# EasyEDA Pro project AE.eprj

# Schematic esquematico-controladora
Board Name: Controladora; Create Date: 2026-03-11; Page Name: FolhaControladora; Project Name: AE; Schematic Name: esquematico-controladora; Update Date: 2026-03-11; Company: EasyEDA.com; Page Size: A4; Version: V1.0
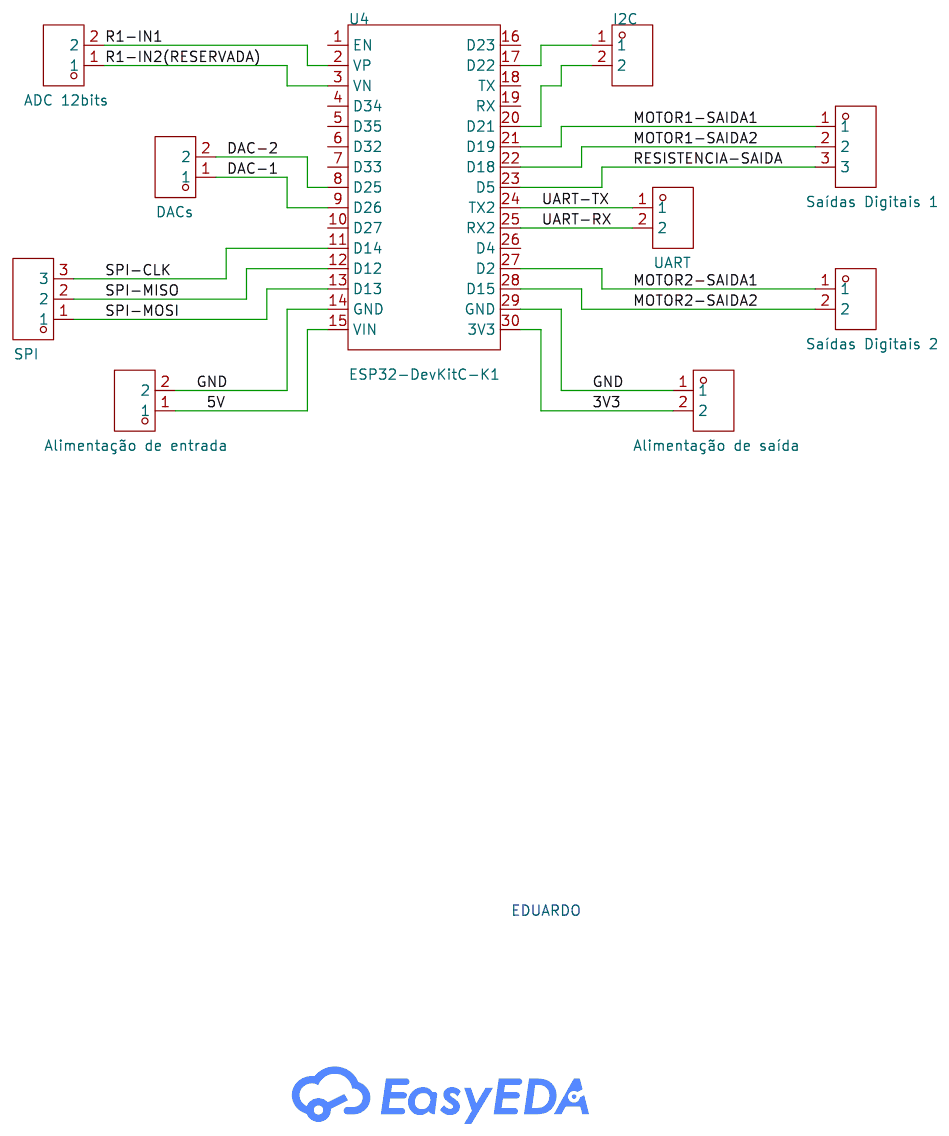
[diagram p0: schematic sheet]

## Parts
ADC12bits  ADC 12bits  [CONN-TH_P5.08_KF128L-5.08-2P]
Alimentaçãodeentrada  Alimentação de entrada  [CONN-TH_P5.08_KF128L-5.08-2P]
Alimentaçãodesaída  Alimentação de saída  [CONN-TH_P5.08_KF128L-5.08-2P]
DACs  DACs  [CONN-TH_P5.08_KF128L-5.08-2P]
I2C  I2C  [CONN-TH_P5.08_KF128L-5.08-2P]
SaídasDigitais1  Saídas Digitais 1  [CONN-TH_3P-P5.00_KF128-5.0-3P]
SaídasDigitais2  Saídas Digitais 2  [CONN-TH_P5.08_KF128L-5.08-2P]
SPI  SPI  [CONN-TH_3P-P5.00_KF128-5.0-3P]
U4  ESP32-DevKitC-K1  [BULETM-SMD_ESP32-DEVKITC]
UART  UART  [CONN-TH_P5.08_KF128L-5.08-2P]

## Library data of the parts
ADC12bits Alimentaçãodeentrada Alimentaçãodesaída DACs I2C SaídasDigitais2 UART = KF128L-5.08-2P: LCSC Part Name: 1x2P 5.08mm 直插 排数:1 每排P数:2; Supplier Part: C474940; Manufacturer: KEFA(科发); Supplier Footprint: 插件,P=5.08mm; JLCPCB Part Class: Extended Part; Datasheet: https://item.szlcsc.com/datasheet/KF128L-5.08-2P/481558.html; Supplier: LCSC; Number of Positions or Pins: 1x2P; Pitch: 5.08mm; Color: Green; Mounting Type: Through Hole; Number of Pins: 2P; Number of Rows: 1; Number of PINs Per Row: 2; Current Rating: 24A; Voltage Rating (Max): 250V; Wire Gauge - AWG: 12~22; Wire Gauge - mm2: 2.5; Operating Temperature: -40℃~+105℃
SaídasDigitais1 = KF128-5.0-3P: LCSC Part Name: 1x3P 5mm 直插 排数:1 每排P数:3; Supplier Part: C474951; Manufacturer: KEFA(科发); Manufacturer Part: SPI; Supplier Footprint: 插件,P=5mm; JLCPCB Part Class: Extended Part; Datasheet: https://item.szlcsc.com/datasheet/KF128-5.0-3P/481569.html; Supplier: LCSC; Number of Positions or Pins: 1x3P; Pitch: 5mm; Color: Green; Mounting Type: Through Hole; Number of Pins: 3P; Number of Rows: 1; Number of PINs Per Row: 3; Current Rating: 24A; Voltage Rating (Max): 250V; Wire Gauge - AWG: 12~22; Wire Gauge - mm2: 2.5; Operating Temperature: -40℃~+105℃
SPI = KF128-5.0-3P: LCSC Part Name: 1x3P 5mm 直插 排数:1 每排P数:3; Supplier Part: C474951; Manufacturer: KEFA(科发); Supplier Footprint: 插件,P=5mm; JLCPCB Part Class: Extended Part; Datasheet: https://item.szlcsc.com/datasheet/KF128-5.0-3P/481569.html; Supplier: LCSC; Number of Positions or Pins: 1x3P; Pitch: 5mm; Color: Green; Mounting Type: Through Hole; Number of Pins: 3P; Number of Rows: 1; Number of PINs Per Row: 3; Current Rating: 24A; Voltage Rating (Max): 250V; Wire Gauge - AWG: 12~22; Wire Gauge - mm2: 2.5; Operating Temperature: -40℃~+105℃
U4 = ESP32-DevKitC: CPU:- ROM Size:- Number of I/O: USB:- WIFI Protocols:- Bluetooth:- Ethernet:- Audio & Video Interface:- Multimedia Support:- Card Type:- Power Supply Type:- Power Supply:- POE Support:- Resolution:- Temperature Range:-; LCSC Part Name: 开发板; Supplier Part: C571180; Manufacturer: ESPRESSIF(乐鑫); JLCPCB Part Class: Extended Part; Datasheet: https://atta.szlcsc.com/upload/public/pdf/source/20200521/C529586_D6FCDAFCFF160B3EDDF7DF28D600699D.pdf; Supplier: LCSC

## Nets
3V3: Alimentaçãodesaída.2 U4.30(3V3)
5V: Alimentaçãodeentrada.1 U4.15(VIN)
GND: Alimentaçãodeentrada.2 Alimentaçãodesaída.1 U4.14(GND) U4.29(GND)
DAC-1: DACs.1 U4.9(D26)
DAC-2: DACs.2 U4.8(D25)
MOTOR1-SAIDA1: SaídasDigitais1.1 U4.21(D19)
MOTOR1-SAIDA2: SaídasDigitais1.2 U4.22(D18)
MOTOR2-SAIDA1: SaídasDigitais2.1 U4.27(D2)
MOTOR2-SAIDA2: SaídasDigitais2.2 U4.28(D15)
R1-IN1: ADC12bits.2 U4.2(VP)
R1-IN2(RESERVADA): ADC12bits.1 U4.3(VN)
RESISTENCIA-SAIDA: SaídasDigitais1.3 U4.23(D5)
SPI-CLK: SPI.3 U4.11(D14)
SPI-MISO: SPI.2 U4.12(D12)
SPI-MOSI: SPI.1 U4.13(D13)
UART-RX: U4.25(RX2) UART.2
UART-TX: U4.24(TX2) UART.1
$1N2586: I2C.1 U4.17(D22)
$1N2592: I2C.2 U4.20(D21)

Not connected (* = marked no-connect by the designer): U4 1(EN) 4(D34) 5(D35) 6(D32) 7(D33) 10(D27) 16(D23) 18(TX) 19(RX) 26(D4)

## Notes on the sheet
- EDUARDO

# Board PCB-controladora
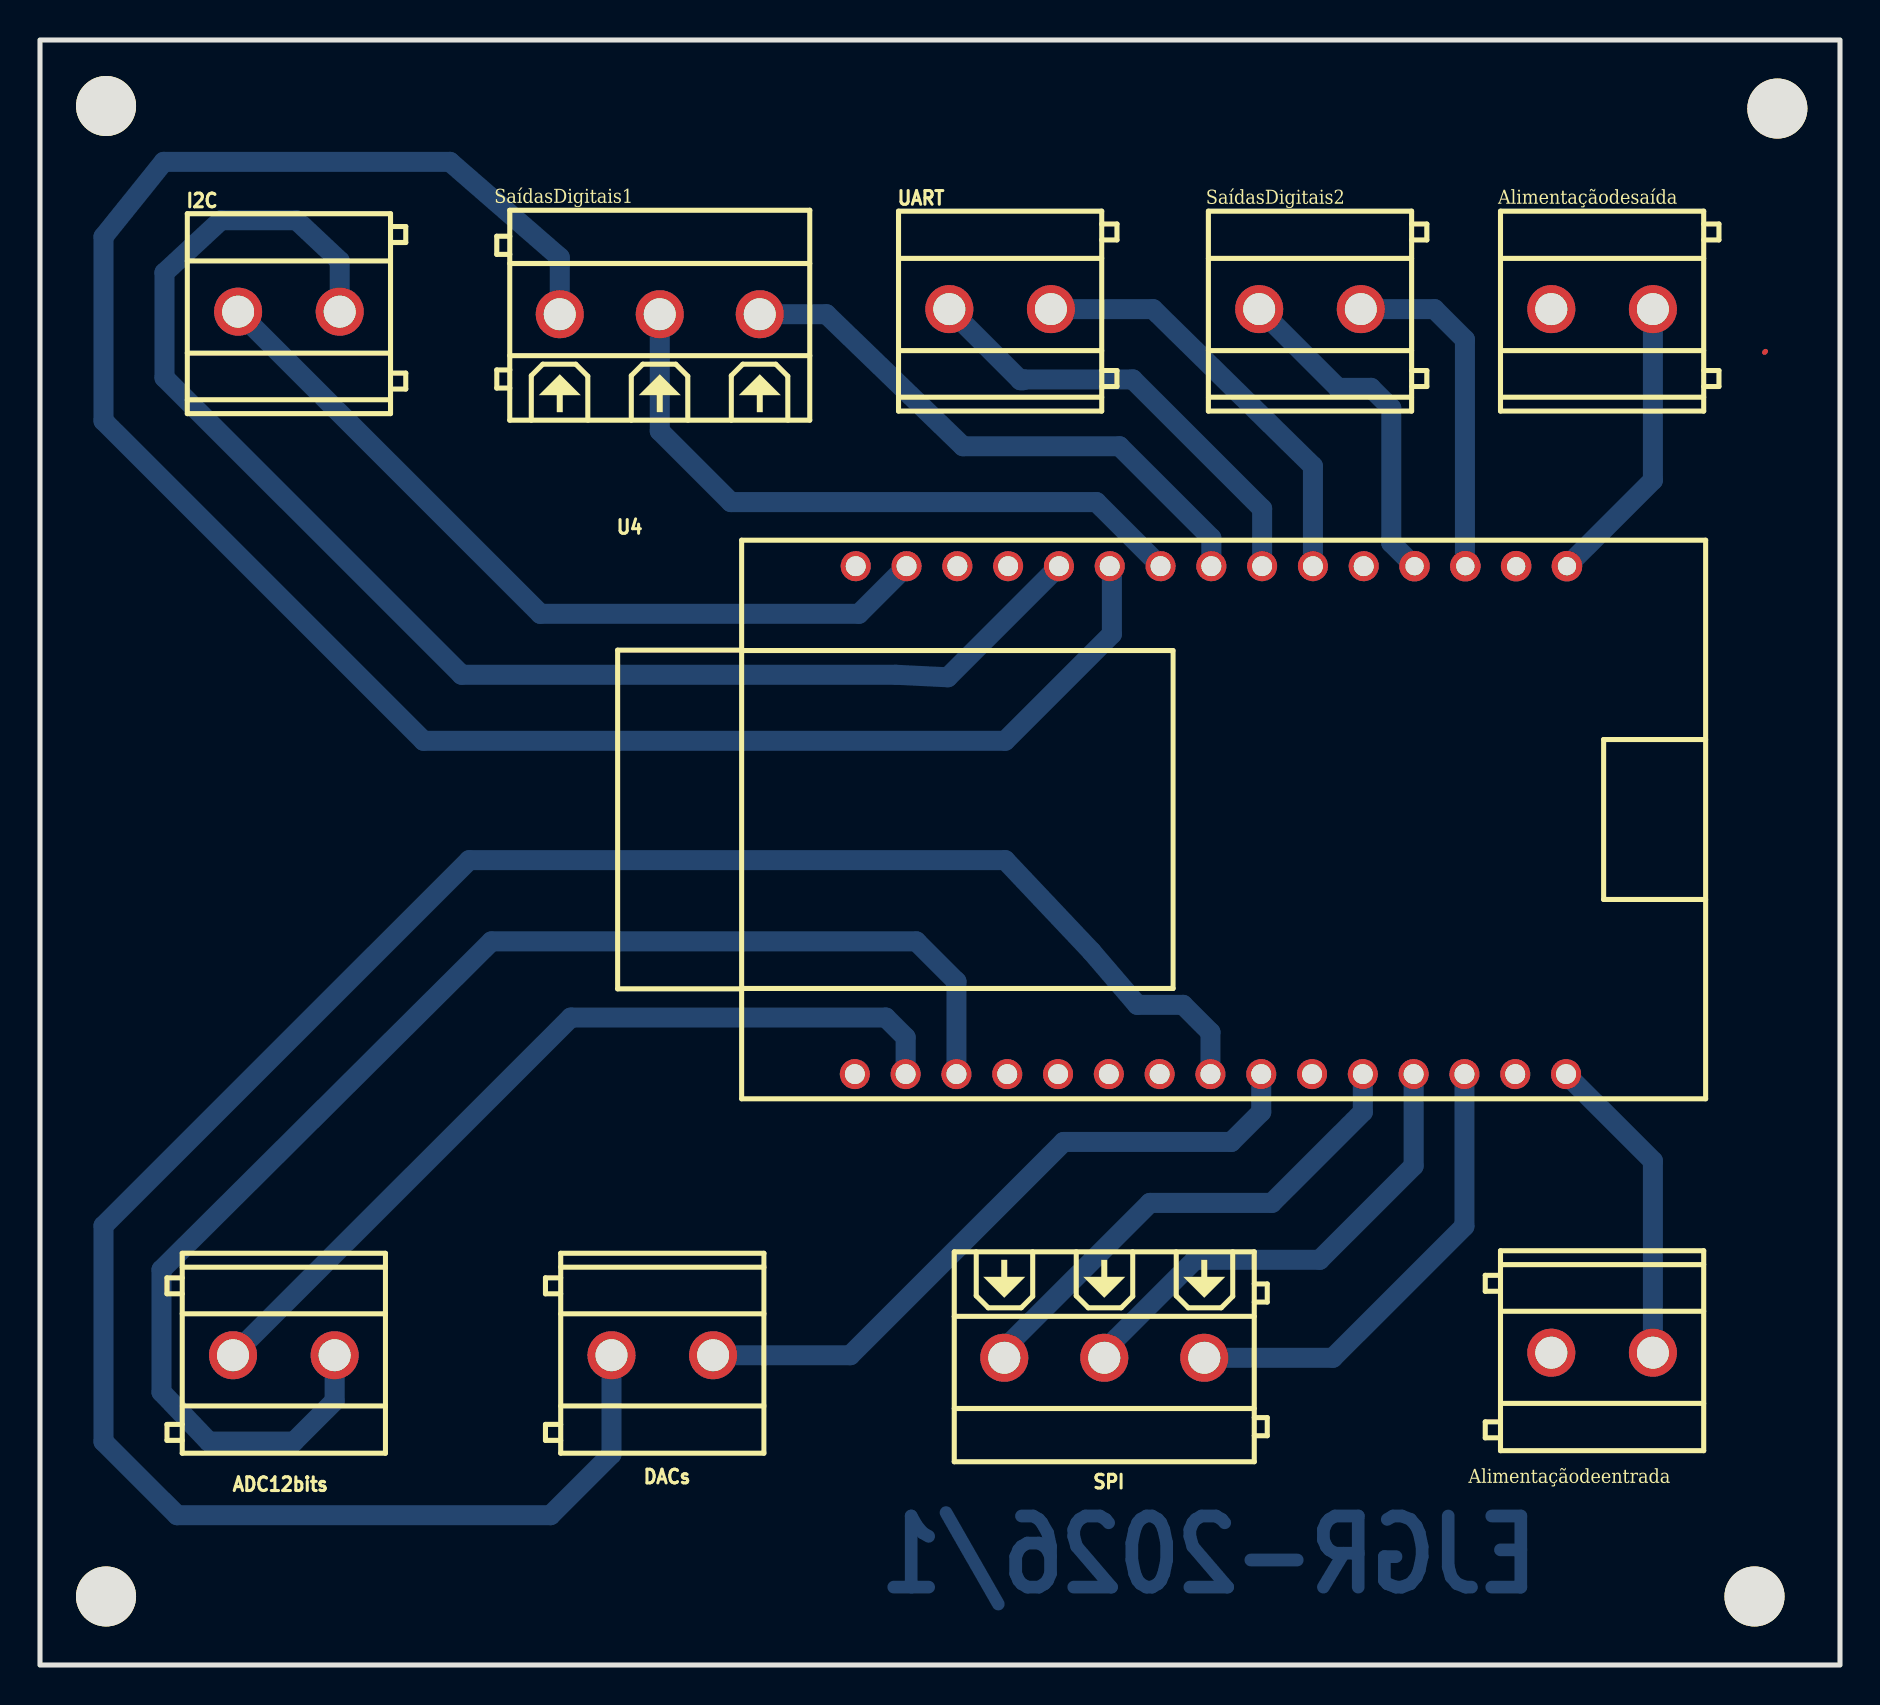
[diagram p1: board, top side]
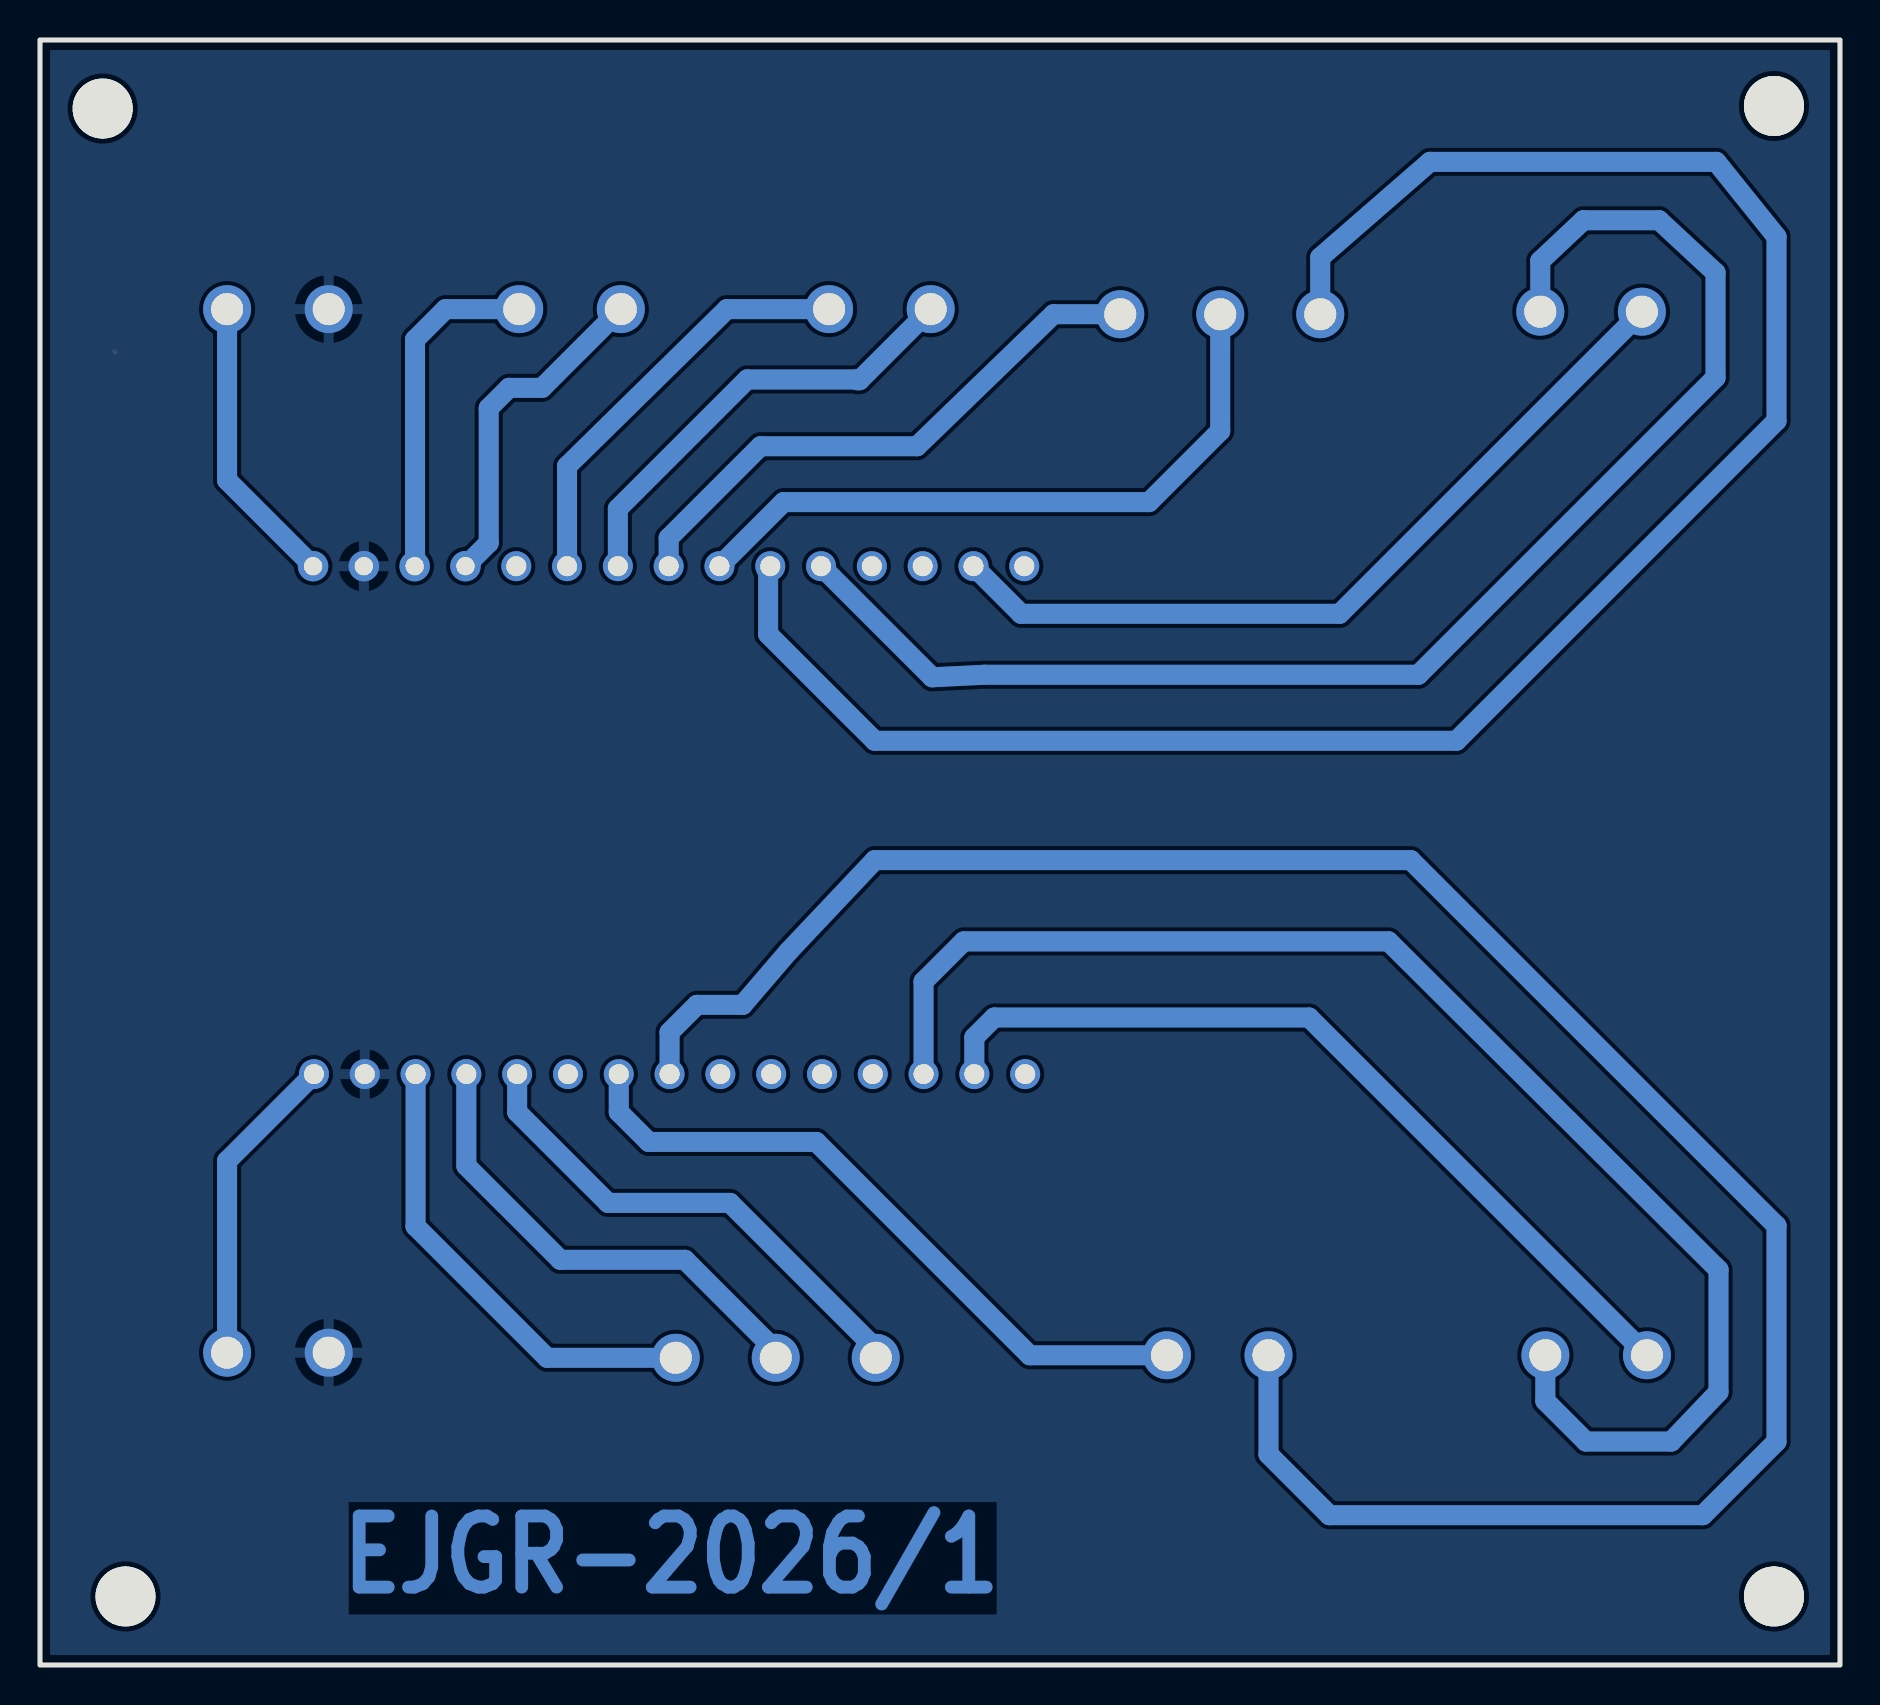
[diagram p2: board, bottom side, seen from below]

Outline 90 x 81.28 mm; copper layers: Top Layer, Bottom Layer. Coordinates in mm from the lower left corner of the outline.
Outline path: rectangle 0,81.28 90,0
Stack: Top Layer 0.035mm / Dielectric1 1.51mm FR4 er 4.5 / Bottom Layer 0.035mm

## Design rules (mm)
template: Custom Config
spacing copperThickness1oz (default): track to track 0.102, other pairs 0.152 to 0.3
spacing copperThickness2oz: track to track 0.203, other pairs 0.152 to 0.3
track width copperThickness1oz (default): min 0.127, default 0.254, max 2.54
track width copperThickness2oz: min 0.203, default 0.254, max 2.54
differential pair differentialPair (default): width min 0.127, default 0.254, max 2.54; gap min 0.152, default 0.152
via viaSize (default): diameter min 0.5, default 0.61, max 10; hole min 0.3, default 0.305, max 6.3
pour e336 uses copperRegion

## Placement (name value [footprint] x y rotation side)
ADC12bits  ADC 12bits  [CONN-TH_P5.08_KF128L-5.08-2P]  12.19 15.49 180 top
Alimentaçãodeentrada  Alimentação de entrada  [CONN-TH_P5.08_KF128L-5.08-2P]  78.1 15.62 180 top
Alimentaçãodesaída  Alimentação de saída  [CONN-TH_P5.08_KF128L-5.08-2P]  78.1 67.82 0 top
DACs  DACs  [CONN-TH_P5.08_KF128L-5.08-2P]  31.12 15.49 180 top
I2C  I2C  [CONN-TH_P5.08_KF128L-5.08-2P]  12.45 67.69 0 top
NOREF  -  [Pad_e24]  85.72 3.43 0 top
NOREF#2  -  [Pad_e17]  3.3 77.98 0 top
NOREF#3  -  [Pad_e22]  86.87 77.85 0 top
NOREF#4  -  [Pad_e23]  3.3 3.43 0 top
SaídasDigitais1  Saídas Digitais 1  [CONN-TH_3P-P5.00_KF128-5.0-3P]  30.99 67.56 0 top
SaídasDigitais2  Saídas Digitais 2  [CONN-TH_P5.08_KF128L-5.08-2P]  63.5 67.82 0 top
SPI  SPI  [CONN-TH_3P-P5.00_KF128-5.0-3P]  53.21 15.37 180 top
U4  ESP32-DevKitC-K1  [BULETM-SMD_ESP32-DEVKITC]  59.18 42.29 0 top
UART  UART  [CONN-TH_P5.08_KF128L-5.08-2P]  48.01 67.82 0 top

## Footprints (pads in the part's own frame, mm; a bottom-side part is the same pattern mirrored in y, then rotated)
BULETM-SMD_ESP32-DEVKITC
  round 1.5 hole 1: 1(-18.44,-12.735) 2(-15.9,-12.735) 3(-13.36,-12.735) 4(-10.82,-12.735) 5(-8.28,-12.735) 6(-5.74,-12.735) 7(-3.2,-12.735) 8(-0.66,-12.735) 9(1.88,-12.735) 10(4.42,-12.735) 11(6.96,-12.735) 12(9.5,-12.735) 13(12.04,-12.735) 14(14.58,-12.735) 15(17.12,-12.735) 16(-18.395,12.67) 17(-15.855,12.67) 18(-13.315,12.67) 19(-10.775,12.67) 20(-8.235,12.67) 21(-5.695,12.67) 22(-3.155,12.67) 23(-0.615,12.67) 24(1.925,12.67) 25(4.465,12.67) 26(7.005,12.67)
  round 1.524 hole 0.914: 27(9.545,12.67) 28(12.085,12.67) 29(14.625,12.67) 30(17.165,12.67)
CONN-TH_3P-P5.00_KF128-5.0-3P
  round 2.4 hole 1.6: 1(-5,0) 2(0,0) 3(5,0)
CONN-TH_P5.08_KF128L-5.08-2P
  round 2.4 hole 1.6: 1(-2.54,0) 2(2.54,0)
Pad_e17
  round 3 hole 3x2.5: 1(0,0)
Pad_e22
  round 3 hole 3x2.5: 1(0,0)
Pad_e23
  round 3 hole 3x2.5: 1(0,0)
Pad_e24
  round 3 hole 3x2.5: 1(0,0)

## Nets
As in the schematic.

Pads without a net: NOREF 1; NOREF#2 1; NOREF#3 1; NOREF#4 1; U4 1 4 5 6 7 10 16 18 19 26

## Routing (per net, layer and track width the routed paths; a pad name or vN(x,y) marks a point on that pad's centre or on a via; arc(x,y) is an arc through that point)
3V3: length 14.6
  Bottom Layer w1.001: Alimentaçãodesaída.2 80.65,59.26 76.35,54.96
5V: length 15.7
  Bottom Layer w1.001: U4.15 80.65,25.21 Alimentaçãodeentrada.1
DAC-1: length 34.3
  Bottom Layer w1.001: DACs.1 40.51,15.49 51.18,26.16 59.56,26.16 61.06,27.66 U4.9
DAC-2: length 112.7
  Bottom Layer w1.001: 28.57,15.49 28.57,10.54 25.53,7.49 6.86,7.49 3.17,11.18 3.17,21.97 21.46,40.26 48.26,40.26 52.58,35.69 54.86,33.02 57.15,33.02 58.52,31.65 U4.8
MOTOR1-SAIDA1: length 101.1
  Bottom Layer w1.001: SaídasDigitais1.1 25.99,70.41 20.5,75.18 6.18,75.18 3.17,71.44 3.17,62.23 19.18,46.23 48.26,46.23 53.59,51.56 53.59,54.85 U4.21
MOTOR1-SAIDA2: length 33.7
  Bottom Layer w1.001: SaídasDigitais1.2 30.99,61.72 34.54,58.17 52.82,58.17 U4.22
MOTOR2-SAIDA1: length 17
  Bottom Layer w1.001: SaídasDigitais2.1 64.9,63.88 66.55,63.88 67.56,62.86 67.56,56.12 68.73,54.96
MOTOR2-SAIDA2: length 17.2
  Bottom Layer w1.001: SaídasDigitais2.2 69.72,67.82 71.25,66.29 71.25,54.98 U4.28
R1-IN1: length 42.9
  Bottom Layer w1.001: ADC12bits.2 26.54,32.39 42.29,32.39 43.28,31.39 U4.2
R1-IN2(RESERVADA): length 71
  Bottom Layer w1.001: ADC12bits.1 14.73,13.21 12.7,11.18 8.44,11.18 6.07,13.66 6.07,19.77 22.57,36.2 43.81,36.2 45.82,34.19 U4.3
RESISTENCIA-SAIDA: length 28.6
  Bottom Layer w1.001: SaídasDigitais1.3 39.32,67.56 46.15,60.96 53.97,60.96 58.57,56.37 58.57,54.96
SPI-CLK: length 25.2
  Bottom Layer w1.001: SPI.3 48.21,15.83 55.5,23.11 61.59,23.11 66.14,27.66 U4.11
SPI-MISO: length 23.9
  Bottom Layer w1.001: 53.22,15.74 57.75,20.27 63.98,20.27 68.68,24.97 U4.12
SPI-MOSI: length 23.3
  Bottom Layer w1.001: SPI.1 64.64,15.37 71.22,21.95 U4.13
UART-RX: length 21.3
  Bottom Layer w1.001: UART.2 55.65,67.82 63.65,59.96 U4.25
UART-TX: length 22.7
  Bottom Layer w1.001: UART.1 49.02,64.26 49.15,64.26 49.19,64.3 54.64,64.3 61.11,57.83 U4.24
$1N2586: length 40.7
  Bottom Layer w1.001: I2C.1 25.02,52.58 40.94,52.58 U4.17
$1N2592: length 71.6
  Bottom Layer w1.001: I2C.2 14.99,70.23 12.83,72.26 9.05,72.26 6.22,69.64 6.22,64.39 21.08,49.53 42.8,49.53 45.39,49.4 U4.20

## Copper pours and planes (outline as drawn; the poured copper is in the pictures)
GND on Bottom Layer: -0.13,81.41 89.87,81.41 89.87,0.13 -0.13,0.13
GND on Bottom Layer: 0,81.28 90,81.28 90,0 0,0

## Text on the board
Bottom Layer: EJGR-2026/1
